# EAGLE design WireHub_2 (EAGLE 9.5.2)
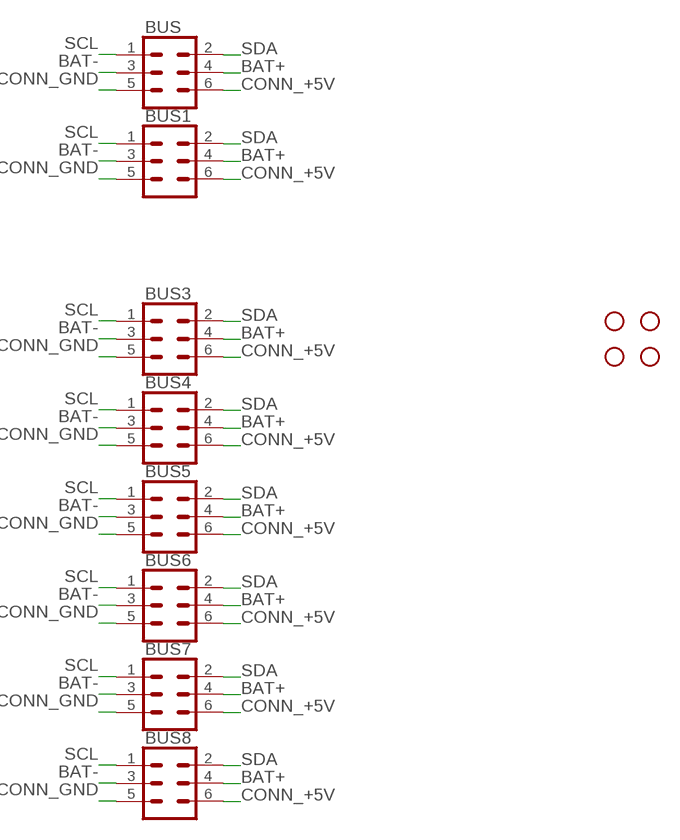
[diagram p0: schematic, sheet 1]

## Parts
BUS  CONN_03X2SHROUD  [2X3-SHROUDED]
BUS1  CONN_03X2SHROUD  [2X3-SHROUDED]
BUS3  CONN_03X2SHROUD  [2X3-SHROUDED]
BUS4  CONN_03X2SHROUD  [2X3-SHROUDED]
BUS5  CONN_03X2SHROUD  [2X3-SHROUDED]
BUS6  CONN_03X2SHROUD  [2X3-SHROUDED]
BUS7  CONN_03X2SHROUD  [2X3-SHROUDED]
BUS8  CONN_03X2SHROUD  [2X3-SHROUDED]
H1  STAND-OFF  [STAND-OFF]
H2  STAND-OFF  [STAND-OFF]
H3  STAND-OFF  [STAND-OFF]
H4  STAND-OFF  [STAND-OFF]

## Nets
BAT+: BUS1.4 BUS3.4 BUS4.4 BUS5.4 BUS6.4 BUS7.4 BUS8.4 BUS.4
BAT-: BUS1.3 BUS3.3 BUS4.3 BUS5.3 BUS6.3 BUS7.3 BUS8.3 BUS.3
CONN_+5V: BUS1.6 BUS3.6 BUS4.6 BUS5.6 BUS6.6 BUS7.6 BUS8.6 BUS.6
CONN_GND: BUS1.5 BUS3.5 BUS4.5 BUS5.5 BUS6.5 BUS7.5 BUS8.5 BUS.5
SCL: BUS1.1 BUS3.1 BUS4.1 BUS5.1 BUS6.1 BUS7.1 BUS8.1 BUS.1
SDA: BUS1.2 BUS3.2 BUS4.2 BUS5.2 BUS6.2 BUS7.2 BUS8.2 BUS.2

## Library data of the parts
BUS BUS1 BUS3-BUS8 = SparkFun-Connectors:CONN_03X2: Multi connection point. Often used as Generic Header-pin footprint for 0.1 inch spaced/style header connections You can populate with any combo of single row headers, but if you'd like an exact match, check these: Header - 2x3 (Male, 0.1") <https://www.sparkfun.com/products/12807> (PRT-12807) Header - 2x3 (Female, 0.1") <https://www.sparkfun.com/products/13010> (PRT-13010) 2x3 Pin Shrouded Header <https://www.sparkfun.com/products/10877> (PRT-10877) On any of the 0.1 inch spaced packages, you can populate with these: Break Away Headers - Straight <https://www.sparkfun.com/products/116> (PRT-00116) Break Away Male Headers - Right Angle <https://www.sparkfun.com/products/553> (PRT-00553) Female Headers <https://www.sparkfun.com/products/115> (PRT-00115) Break Away Headers - Machine Pin <https://www.sparkfun.com/products/117> (PRT-00117) Break Away Female Headers - Swiss Machine Pin <https://www.sparkfun.com/products/743> (PRT-00743) Special note: the shrouded connector mates well with our 3x2 ribbon cables: Ribbon Crimp Connector - 6-pin (2x3, Female) <https://www.sparkfun.com/products/10651> (PRT-10651) Ribbon Cable - 6 wire (15ft) <https://www.sparkfun.com/products/10646> (PRT-10646); PROD_ID: CONN-10681; SF_ID: PRT_10877
H1-H4 = SparkFun-Hardware:STAND-OFF: Stand Off Drill holes for mechanically mounting via screws, standoffs, etc. Note: Use the keepout ring to avoid running the screw head into surrounding components. Variant Overviews STAND-OFF - Mechanical footprint for a #4 phillips button head screw. STAND-OFF-TIGHT - Mechanical footprint for a #4 phillips button head screw, Example SparkFun Products Screw - Phillips Head (1/4", 4-40, 10 pack) <https://www.sparkfun.com/products/10453> (PRT-10453) Screw - Phillips Head (1/2", 4-40, 10 pack) <https://www.sparkfun.com/products/10452> (PRT-10452) Screw - Phillips Head (3/4", 4-40, 10 pack) <https://www.sparkfun.com/products/10451> (PRT-10451) Screw - Phillips Head (1", 4-40, 10 pack) <https://www.sparkfun.com/products/10450> (PRT-10450)

## Board
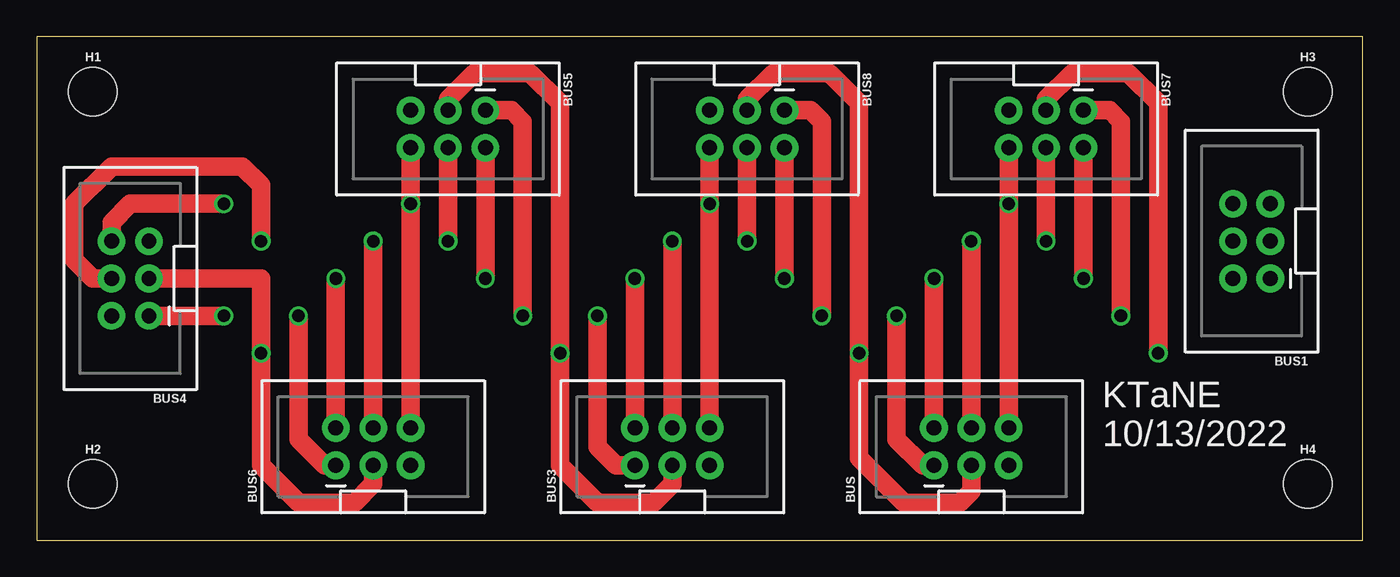
[diagram p1: board, top side]
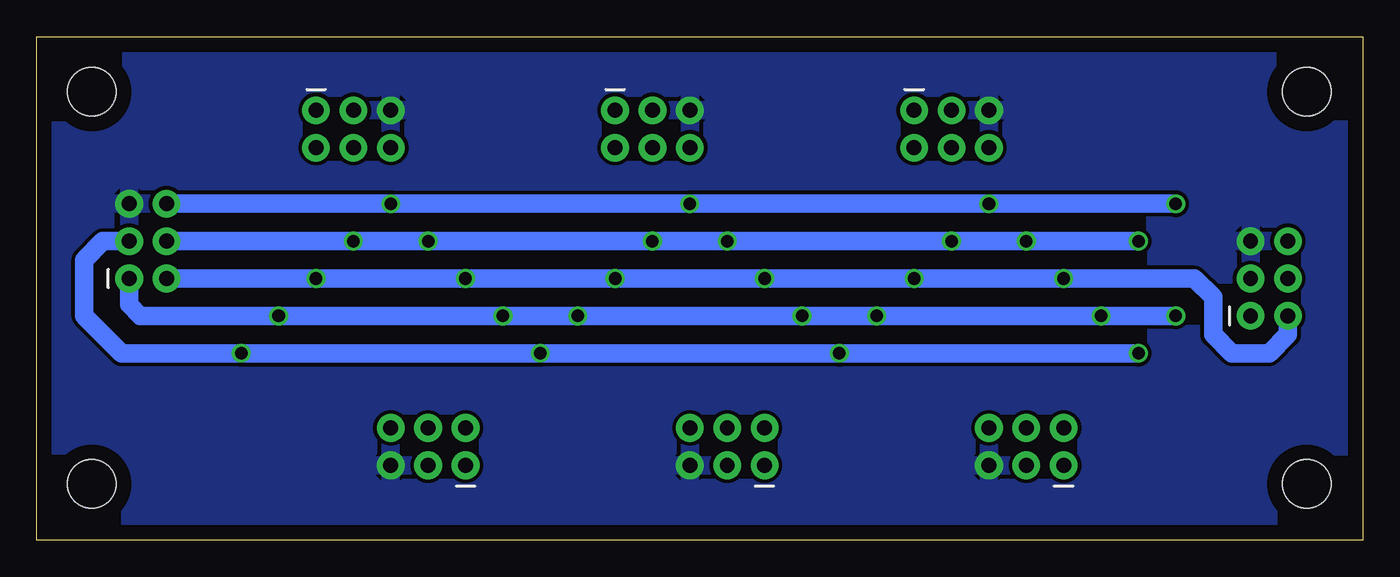
[diagram p2: board, bottom side, seen from below]

Size 90.09 x 34.21 mm. Coordinates in mm from the lower left corner, seen from the top.
Outline: 0,0 90.09,0 90.09,34.21 0,34.21 0,0
Copper layers (1*16): Top 0.035mm / dielectric 1.5mm / Bottom 0.035mm
Design rules "default": minimum track width 6mil, minimum drill 0.35mm, track to track 6mil, track to pad 6mil, pad to pad 6mil, via to via 6mil, smd to smd 6mil, copper to edge 40mil, drill to drill 6mil, minimum pad ring 10mil, minimum via ring 8mil, stop-mask expansion 4mil, vias tented up to drill 0mil, thermal gap 10mil

### Footprints (pad centres in the part's own frame; a part is rotated, then mirrored left to right if it is on the bottom)
2X3-SHROUDED = drill 1.016 pad 1.88: 1 -1.27,2.54; 2 1.27,2.54; 3 -1.27,0; 4 1.27,0; 5 -1.27,-2.54; 6 1.27,-2.54
STAND-OFF = hole 3.302: 0,0

### Placement (x,y rotation side)
BUS  63.5,6.35 90 top
BUS1  82.55,20.32 180 top
BUS3  43.18,6.35 90 top
BUS4  6.35,17.78 180 top
BUS5  27.94,27.94 270 top
BUS6  22.86,6.35 90 top
BUS7  68.58,27.94 270 top
BUS8  48.26,27.94 270 top
H1  3.81,30.48 0 top
H2  3.81,3.81 0 top
H3  86.36,30.48 0 top
H4  86.36,3.81 0 top

### Tracks (layer width: path | path; a pad name or v marks a point on that pad's centre or on a via)
BAT+  (via drill 0.85)
  Top 1.27: BUS5.4 v27.94,20.32 | BUS8.4 v48.26,20.32 | BUS7.4 v68.58,20.32 | v63.5,20.32 BUS.4 | v22.86,20.32 BUS6.4 | v43.18,20.32 BUS3.4 | BUS4.4 3.81,17.78 2.54,19.05 2.54,22.86 5.08,25.4 13.97,25.4 15.24,24.13 v15.24,20.32
  Bottom 1.27: BUS1.4 v68.58,20.32 v63.5,20.32 v48.26,20.32 v43.18,20.32 v27.94,20.32 v22.86,20.32 v15.24,20.32
BAT-  (via drill 0.85)
  Top 1.27: BUS5.3 27.94,29.97 29.72,31.75 33.53,31.75 35.56,29.72 v35.56,12.7 35.56,5.08 38.1,2.54 41.91,2.54 43.18,3.81 BUS3.3 | BUS8.3 48.26,29.97 50.04,31.75 53.85,31.75 55.88,29.72 v55.88,12.7 55.88,5.59 58.93,2.54 62.74,2.54 63.5,3.3 BUS.3 | BUS7.3 68.58,29.97 70.36,31.75 74.17,31.75 76.2,29.72 v76.2,12.7 | BUS6.3 22.86,3.81 21.59,2.54 17.78,2.54 15.24,5.08 v15.24,12.7 15.24,17.78 BUS4.3
  Bottom 1.27: BUS1.3 85.6,20.32 86.87,19.05 86.87,15.24 84.33,12.7 v76.2,12.7 v55.88,12.7 v35.56,12.7 v15.24,12.7
CONN_+5V  (via drill 0.85)
  Top 1.27: BUS5.6 v25.4,22.86 BUS6.6 | BUS8.6 v45.72,22.86 BUS3.6 | BUS7.6 v66.04,22.86 BUS.6 | BUS4.6 5.08,21.59 6.35,22.86 v12.7,22.86
  Bottom 1.27: BUS1.6 v66.04,22.86 v45.72,22.86 v25.4,22.86 v12.7,22.86
CONN_GND
  pour Bottom (isolate 0.254): 0,34.29 90.17,34.29 90.17,0 0,0
SCL  (via drill 0.85)
  Top 1.27: BUS5.1 32.26,29.21 33.02,28.45 v33.02,15.24 | BUS8.1 52.58,29.21 53.34,28.45 v53.34,15.24 | BUS7.1 72.9,29.21 73.66,28.45 v73.66,15.24 | BUS.1 60.2,5.08 58.42,6.86 v58.42,15.24 | BUS6.1 19.56,5.08 17.78,6.86 v17.78,15.24 | BUS3.1 39.37,5.08 38.1,6.35 v38.1,15.24 | BUS4.1 v12.7,15.24
  Bottom 1.27: BUS1.1 83.82,16 83.06,15.24 v73.66,15.24 v58.42,15.24 v53.34,15.24 v38.1,15.24 v33.02,15.24 v17.78,15.24 v12.7,15.24
SDA  (via drill 0.85)
  Top 1.27: BUS5.2 v30.48,17.78 | BUS8.2 v50.8,17.78 | BUS7.2 v71.12,17.78 | v60.96,17.78 BUS.2 | v20.32,17.78 BUS6.2 | v40.64,17.78 BUS3.2
  Bottom 1.27: BUS1.2 v71.12,17.78 v60.96,17.78 v50.8,17.78 v40.64,17.78 v30.48,17.78 v20.32,17.78 11.43,17.78 10.16,16.51 10.16,13.97 8.89,12.7 6.35,12.7 5.08,13.97 BUS4.2

### Text on the board
tPlace: KTaNE / 10/13/2022